# Altium schematic sheet MicroDial_Data_Log_V2_Part3.SchDoc: MicroDial_Data_Log_V2
size A4; Author: Burak DURU; Organization: CNRS DT INSU UPS855; Address1: 1, place Aristide Briand; Address2: 92195 Meudon Cedex; Address3: Tel : 01 45 07 50 50; Address4: FRANCE; DocumentNumber: 3; Revision: 2.0; SheetNumber: 3; SheetTotal: 4
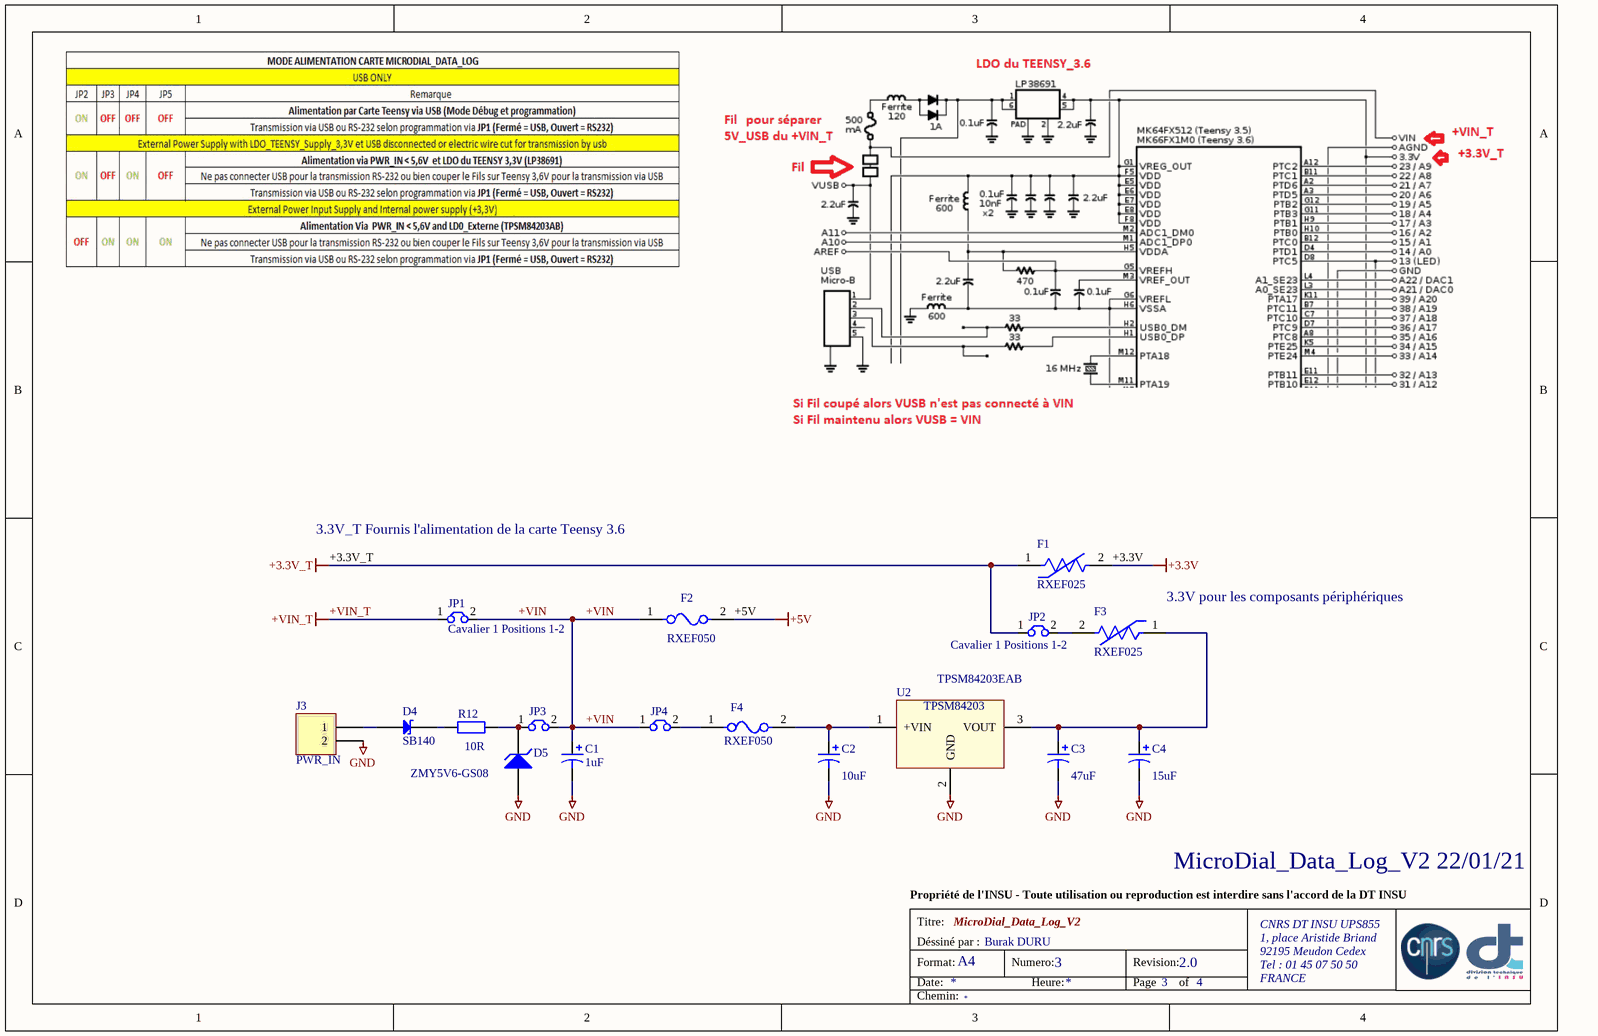
[diagram p0: MicroDial_Data_Log_V2_Part3.SchDoc]

## Parts
C1  value 1uF  [CAPPR5-10*x11.5]  (hidden comment: Condensateur Nichicon, 1μF, 450V c.c., série PS)
C2  value 10uF  [CAPA-B]  (hidden comment: Polarized Capacitor Tantale)
C3  value 47uF  [CAPA-B]  (hidden comment: Polarized Capacitor Tantale)
C4  value 15uF  [CAPA-D]  (hidden comment: Polarized Capacitor Tantale)
D4  SB140  [DO-41]
D5  ZMY5V6-GS08  [MELF DO-213AB]
F1  RXEF025  [FP-RXEF025-MFG]
F2  RXEF050  [FP-RXEF050-MFG]
F3  RXEF025  [FP-RXEF025-MFG]
F4  RXEF050  [FP-RXEF050-MFG]
J3  PWR_IN  [SL 3.5/2/90G]
JP1  Cavalier 1 Positions 1-2  [Molex 90120-0762]
JP2  Cavalier 1 Positions 1-2  [Molex 90120-0762]
JP3  Cavalier 1 Positions 1-2  [Molex 90120-0762]  (value not drawn)
JP4  Cavalier 1 Positions 1-2  [Molex 90120-0762]  (value not drawn)
R12  value 10R  [R1206]  (hidden comment: Res)
U2  TPSM84203EAB  [TPSM842XX SIPMODULE]

## Nets
+3.3V: F1.2
+3.3V_T: F1.1 JP2.1
+5V: F2.2
+VIN_T: JP1.1
GND: C1.2 C2.2 C3.2 C4.2 D5.1(A) J3.2 U2.2(GND)
+VIN: C1.1 F2.1 JP1.2 JP3.2 JP4.1
NetC2_1: C2.1 F4.2 U2.1(+VIN)
NetC3_1: C3.1 C4.1 F3.1 U2.3(VOUT)
NetD4_1: D4.1(A) J3.1
NetD4_2: D4.2(K) R12.1
NetD5_2: D5.2(K) JP3.1 R12.2
NetF3_2: F3.2 JP2.2
NetF4_1: F4.1 JP4.2

## Notes on the sheet
- 3.3V_T Fournis l'alimentation de la carte Teensy 3.6
- (near F3) 3.3V pour les composants périphériques
- MicroDial_Data_Log_V2 22/01/21
- Propriété de l'INSU - Toute utilisation ou reproduction est interdire sans l'accord de la DT INSU
- Titre:
- Format:
- Date:
- Déssiné par :
- A4
- Numero:
- Heure:
- Revision:
- Page
- of
- Chemin:
- (in symbol TPSM84203EAB) TPSM84203

## Library data of the parts
C1 = Cap  Aluminuim Pol: Code Commande: RS851-5339
C2 = Cap Tantale Pol: 293D106X9025B2TE3 -  Condensateur tantale CMS, TANTAMOUNT®, 10 µF, 25 V, 1411 [3528 Metric], Série 293D, ± 10%, -55 °C; Code Commande: F235-3056
C3 = Cap Tantale Pol: T491B476K010AT -  Condensateur tantale CMS, 47 µF, 10 V, 1411 [3528 Metric], Série T491, ± 10%, -55 °C; Code Commande: F145-7458
C4 = Cap Tantale Pol: T491D156K035AT / Condensateur tantale CMS, 15 µF, 35 V, 2917 [7343 Metric], Série T491, ± 10%, -55 °C; Code Commande: F145-7496
D4 = Diode_Schottky: SB140 Redresseur Schottky, 40 V, 1 A, Une, DO-41 (DO-204AL), 2 Broche(s), 500 mV; Code Commande: F146-7528; Value: SB140
D5 = ZMY5V6-GS08: ZMY5V6-GS08 Diode simple Zener, AEC-Q101, 5.6 V, 1 W, MELF, 2 Broche(s), 175 °C /; Code Commande: F161-7742; Value: ZMY5V6-GS08
F1 F3 = RXEF025: RXEF025 -  FUSE, PTC RESET, 72V, 250mA, RADIAL; Code Commande: F266-8022; ComponentLink2URL: https://www.littelfuse.com/~/media/electronics/datasheets/resettable_ptcs/littelfuse_ptc_radial_leaded_rxef_datasheet.pdf.pdf; ComponentLink2Description: Datasheet; Value: RXEF025
F2 F4 = RXEF050: RXEF050 -  Fusible PPTC réarmable, broches radiales, Série PolySwitch RXEF, 72 VDC, 500 mA, 1 A, 4 s, Rond; Code Commande: F117-5864; ComponentLink2Description: Datasheet; ComponentLink2URL: https://www.littelfuse.com/~/media/electronics/datasheets/resettable_ptcs/littelfuse_ptc_radial_leaded_rxef_datasheet.pdf.pdf; Value: RXEF050
J3 = WEIDMULLER SL 3.5/2/90G: WEIDMULLER SL 3.5/2/90B SR 2V COUDE; Code Commande: RS171-578; Value: WEIDMULLER SL 3.5/2/90G
JP1-JP4 = Jump 12: Jumper 2 Wire; Value: Molex 90120-0762; Code Commande: F973-3302
R12 = Res: CRM1206-FX-10R0ELF -  Résistance à puce CMS, 10 ohm, ± 1%, 500 mW, 1206 [3216 Metric], Couche épaisse, Haute puissance,± 100ppm/°C; Code Commande: F186-5248
U2 = TPSM84203EAB: TPSM84203EAB -  Convertisseur DC/DC, 1 sortie, 4.95 W, 3.3 V, 1.5 A, TPSM842xx Family; Code Commande: F300-9711 / Mouser 595-TPSM84203EAB; Value: TPSM84203EAB -  Convertisseur DC/DC, 1 sortie, 4.95 W, 3.3 V, 1.5 A, TPSM842xx Family